# EAGLE board firetirs (EAGLE 7.7.0), part 1 of 2
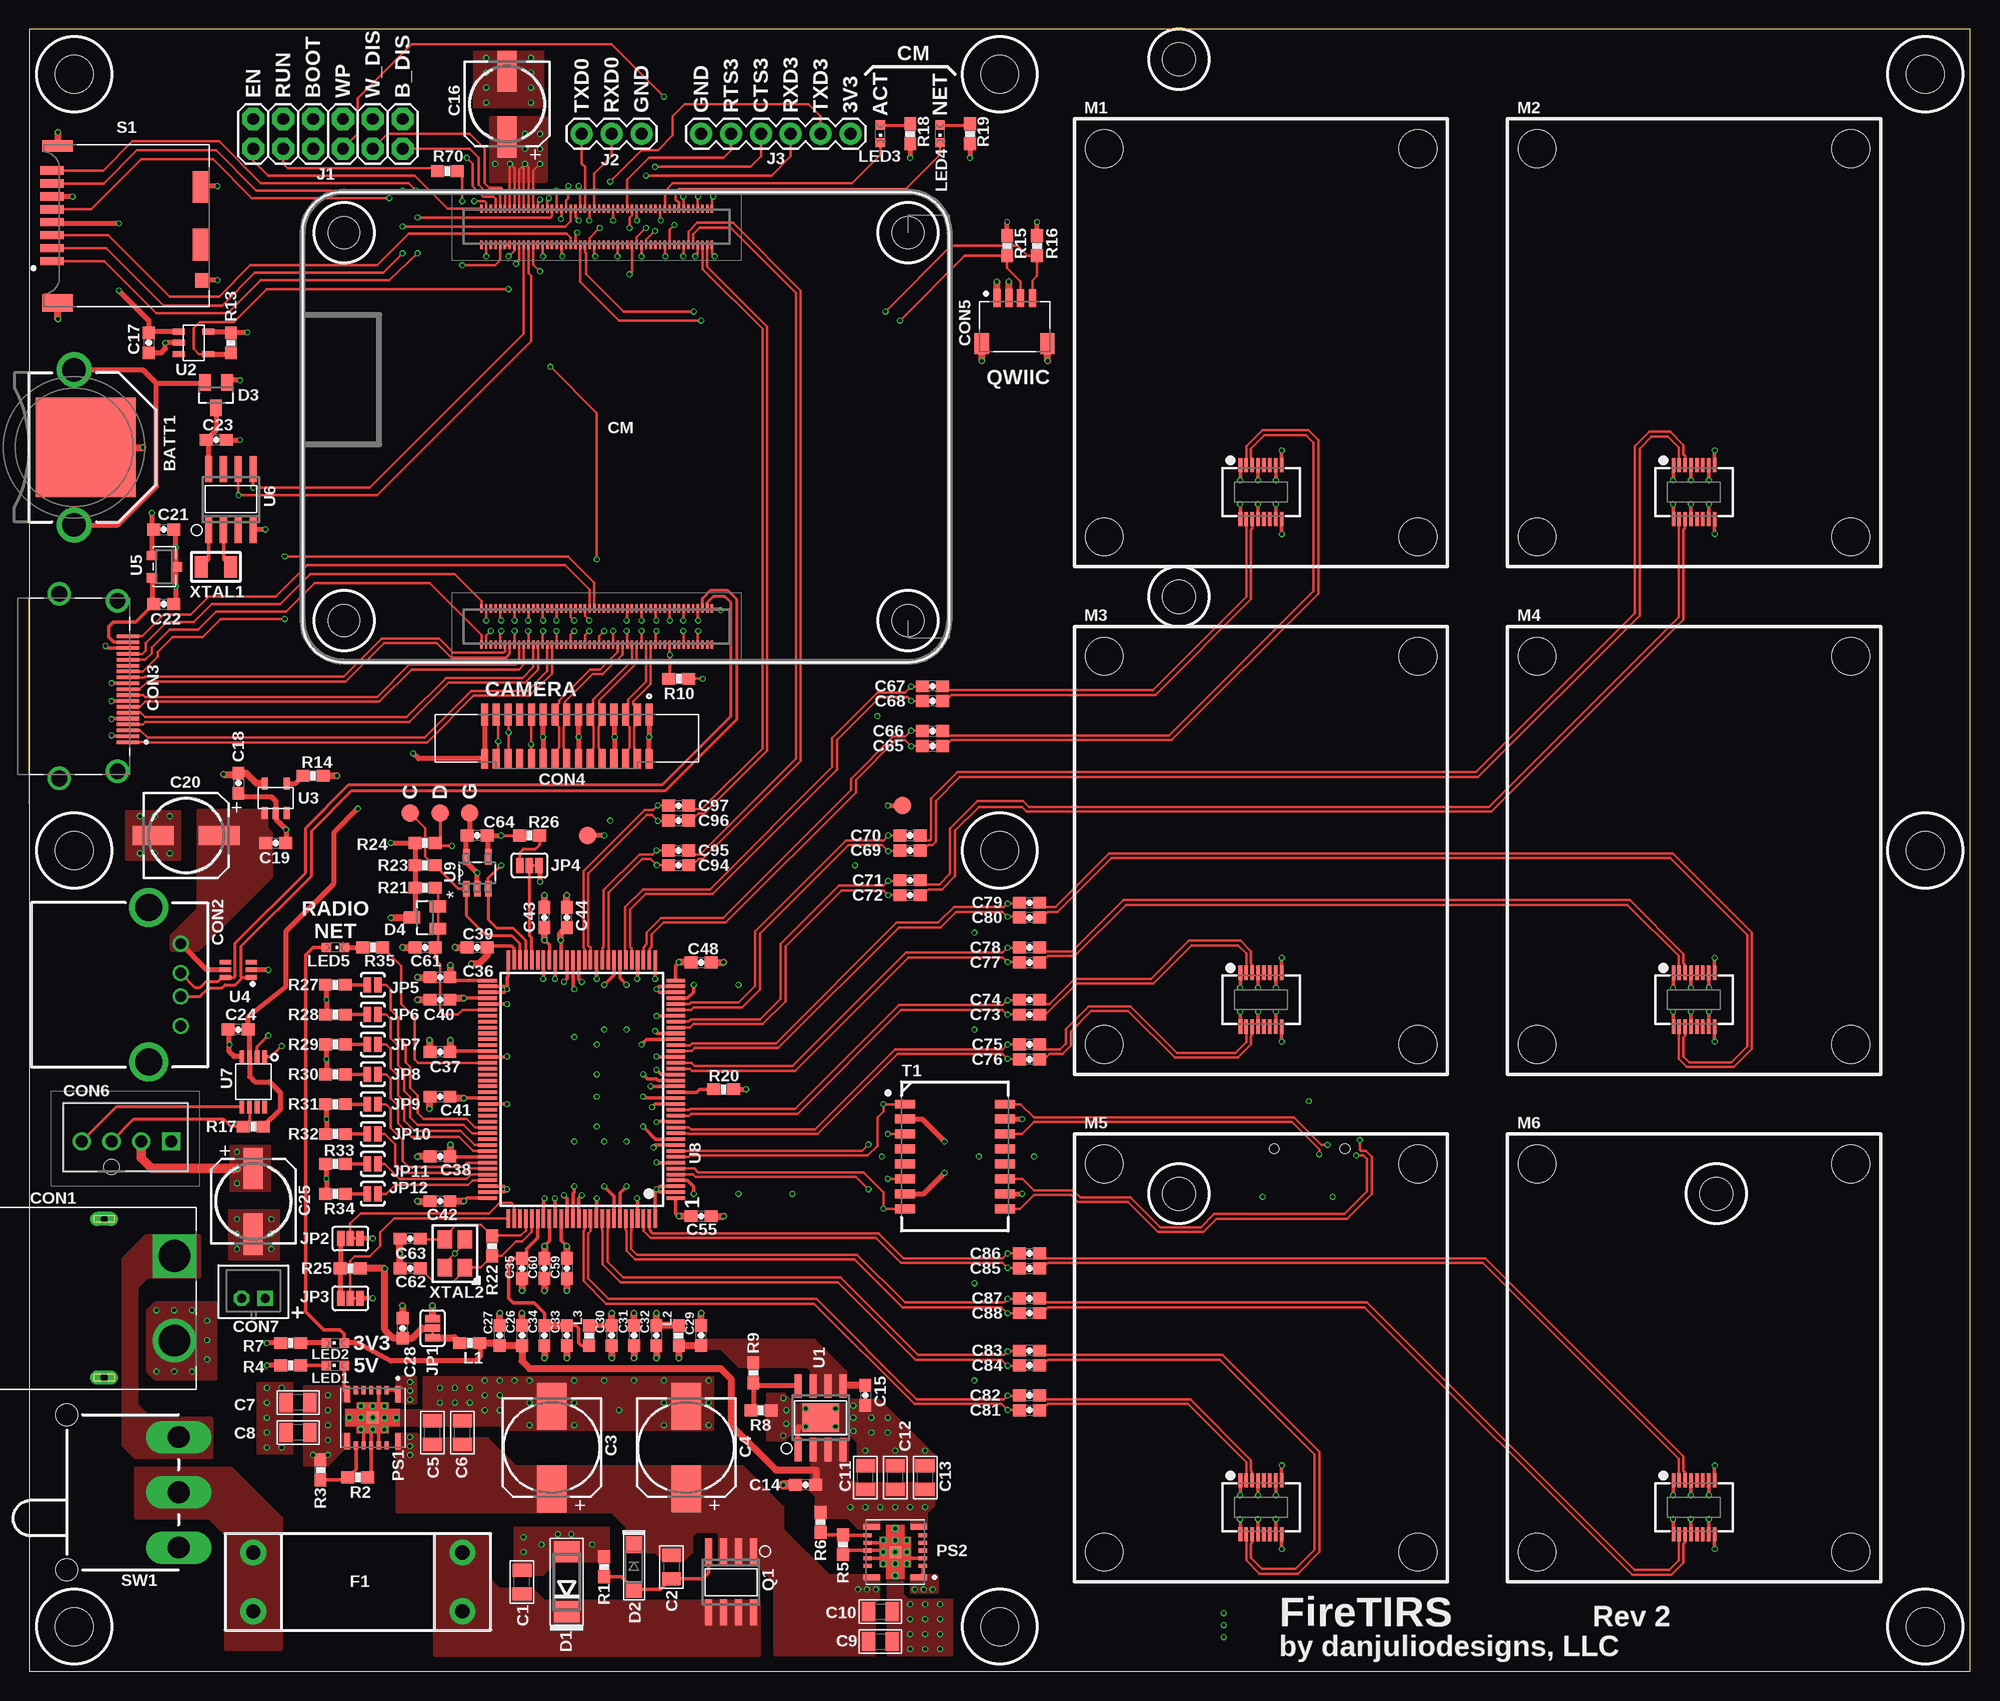
[diagram p7: board, top side]
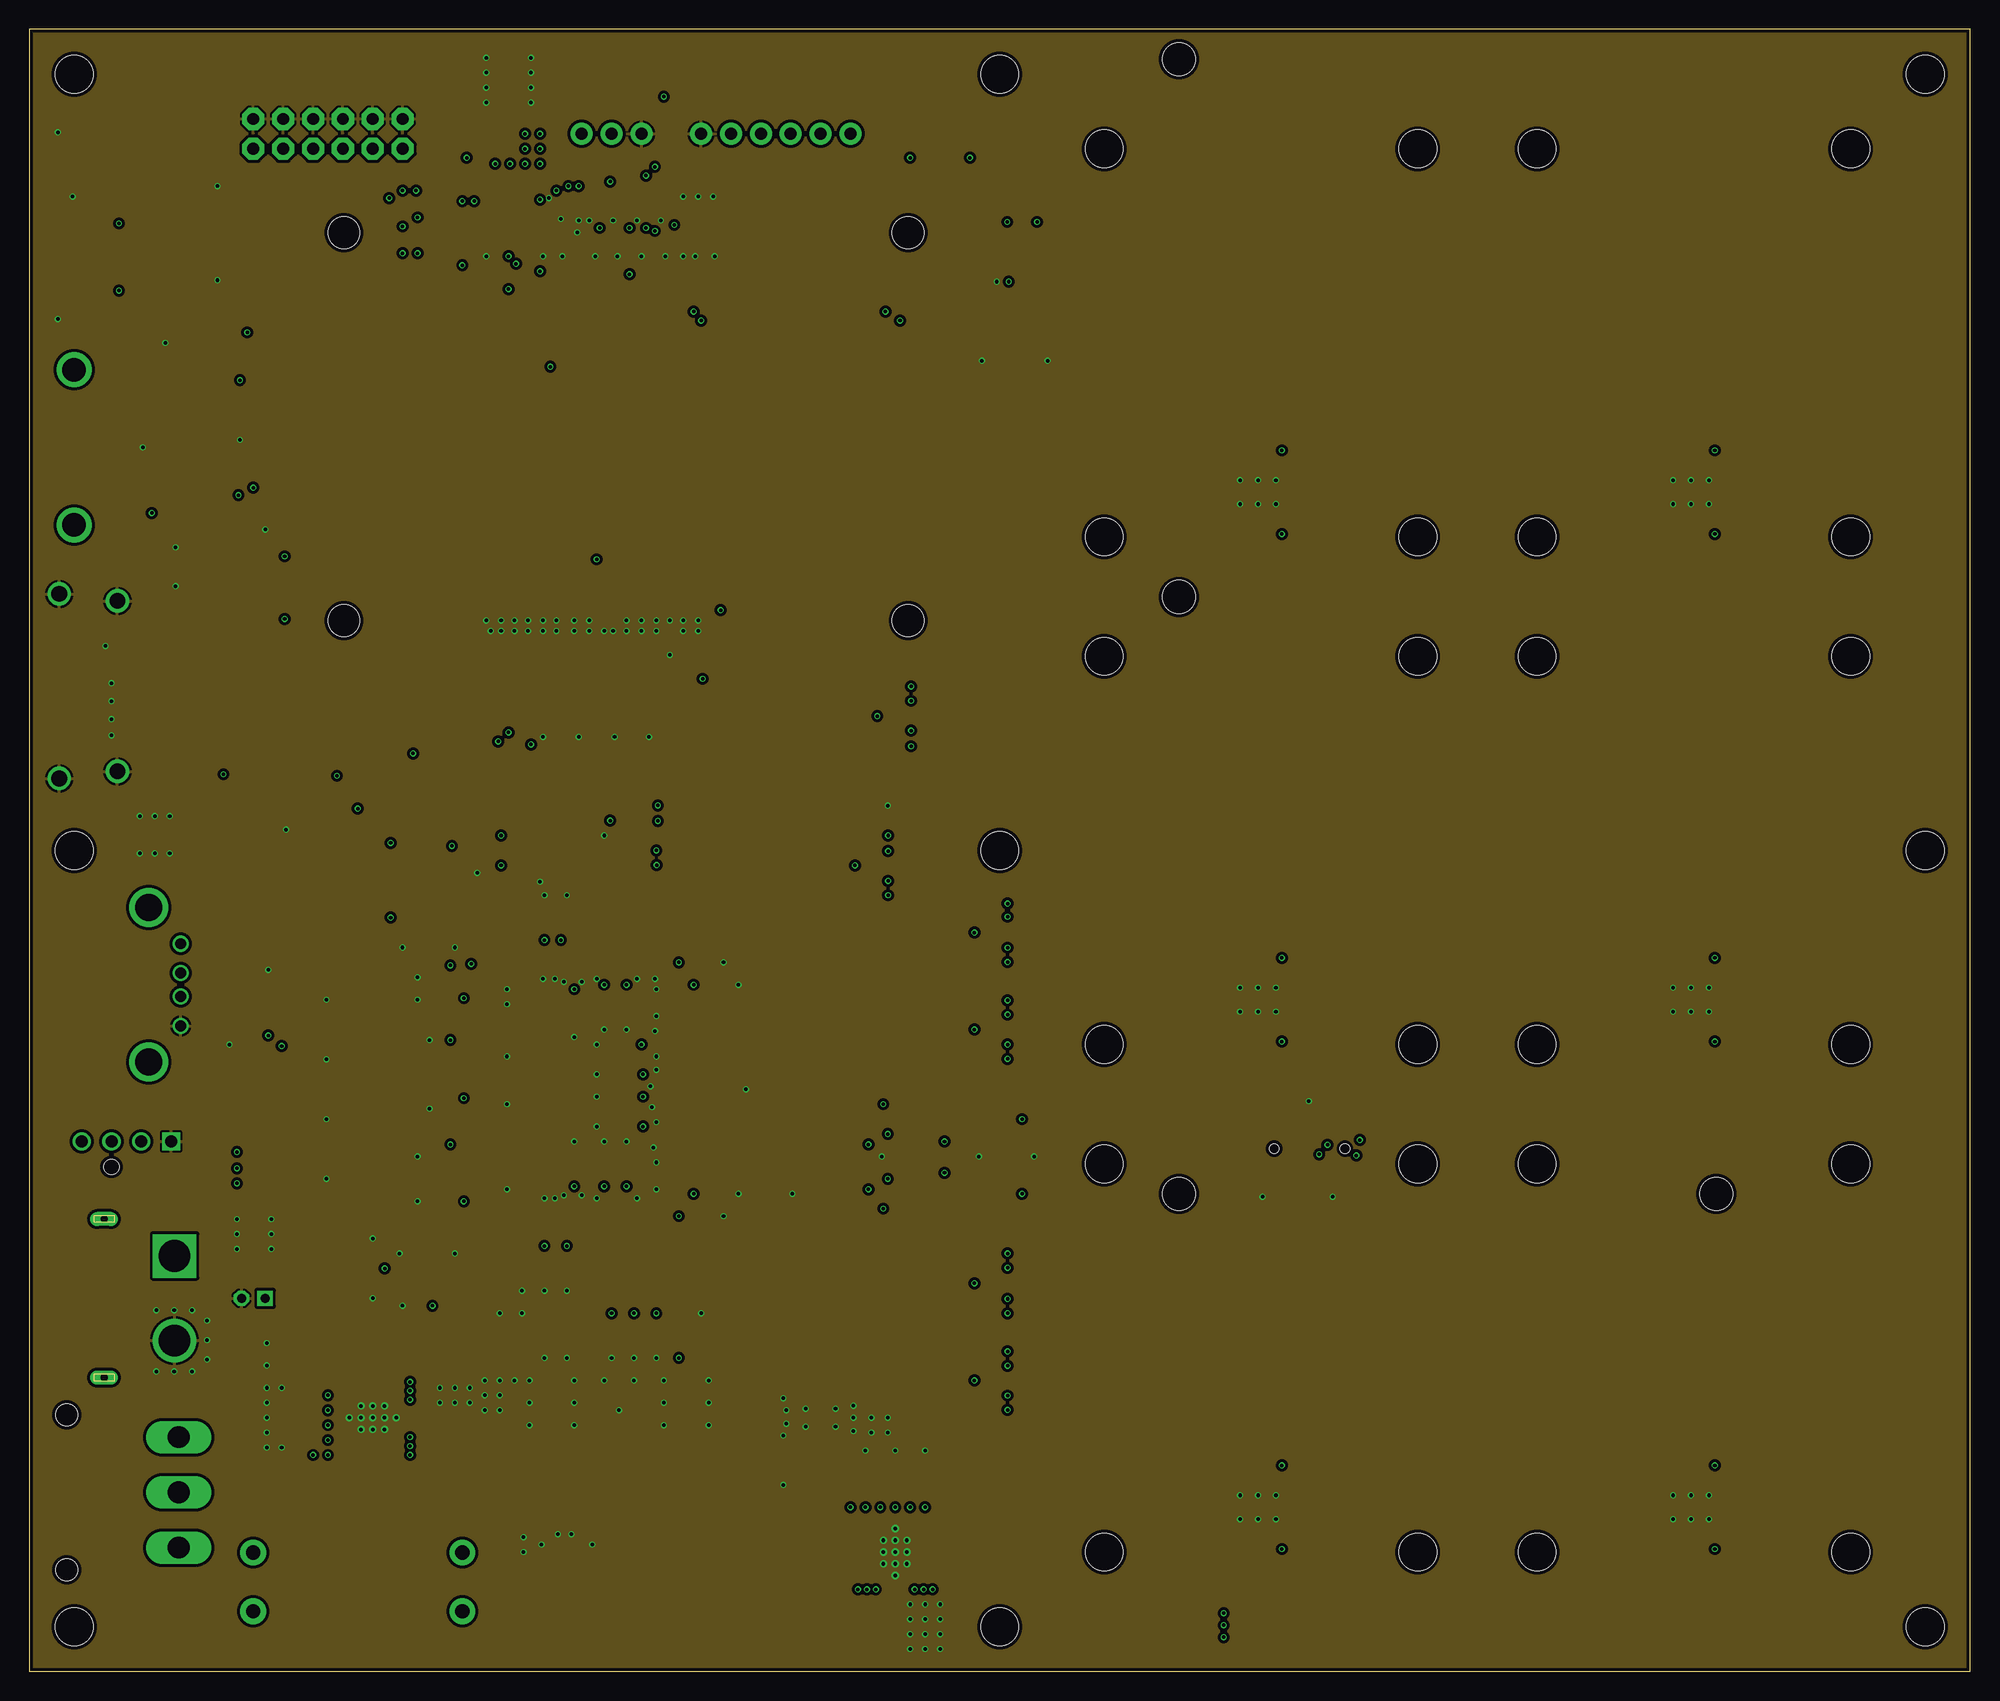
[diagram p8: board, inner layer Route2]
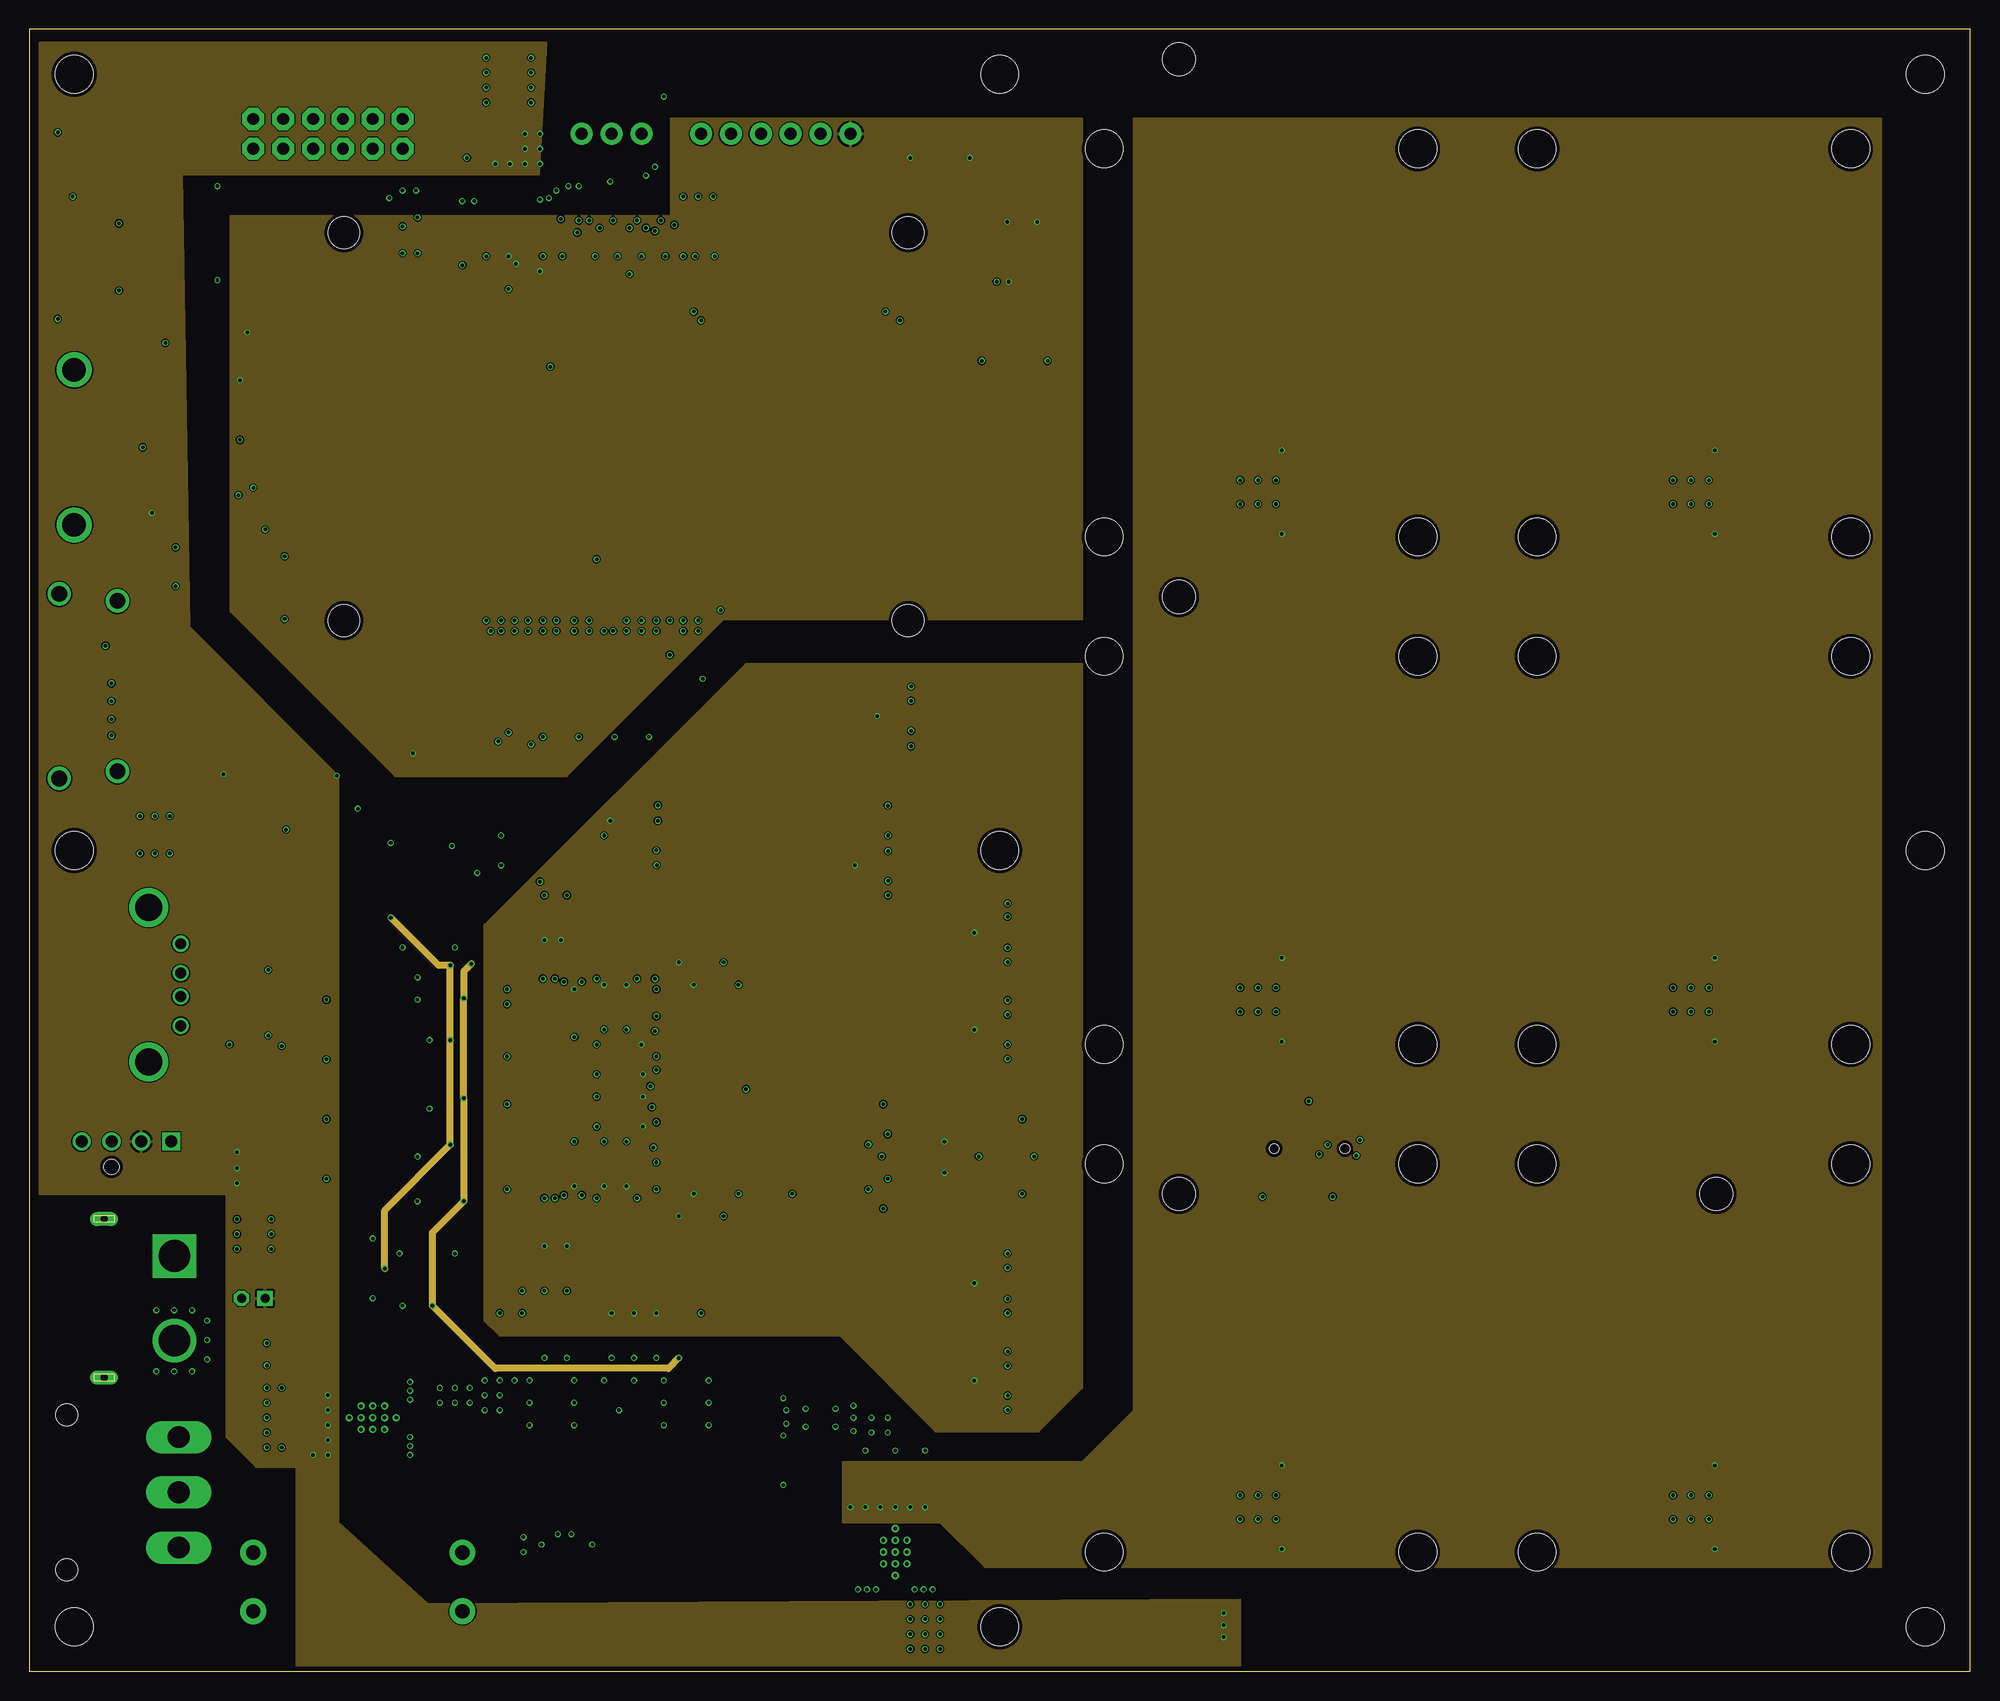
[diagram p9: board, inner layer Route15]
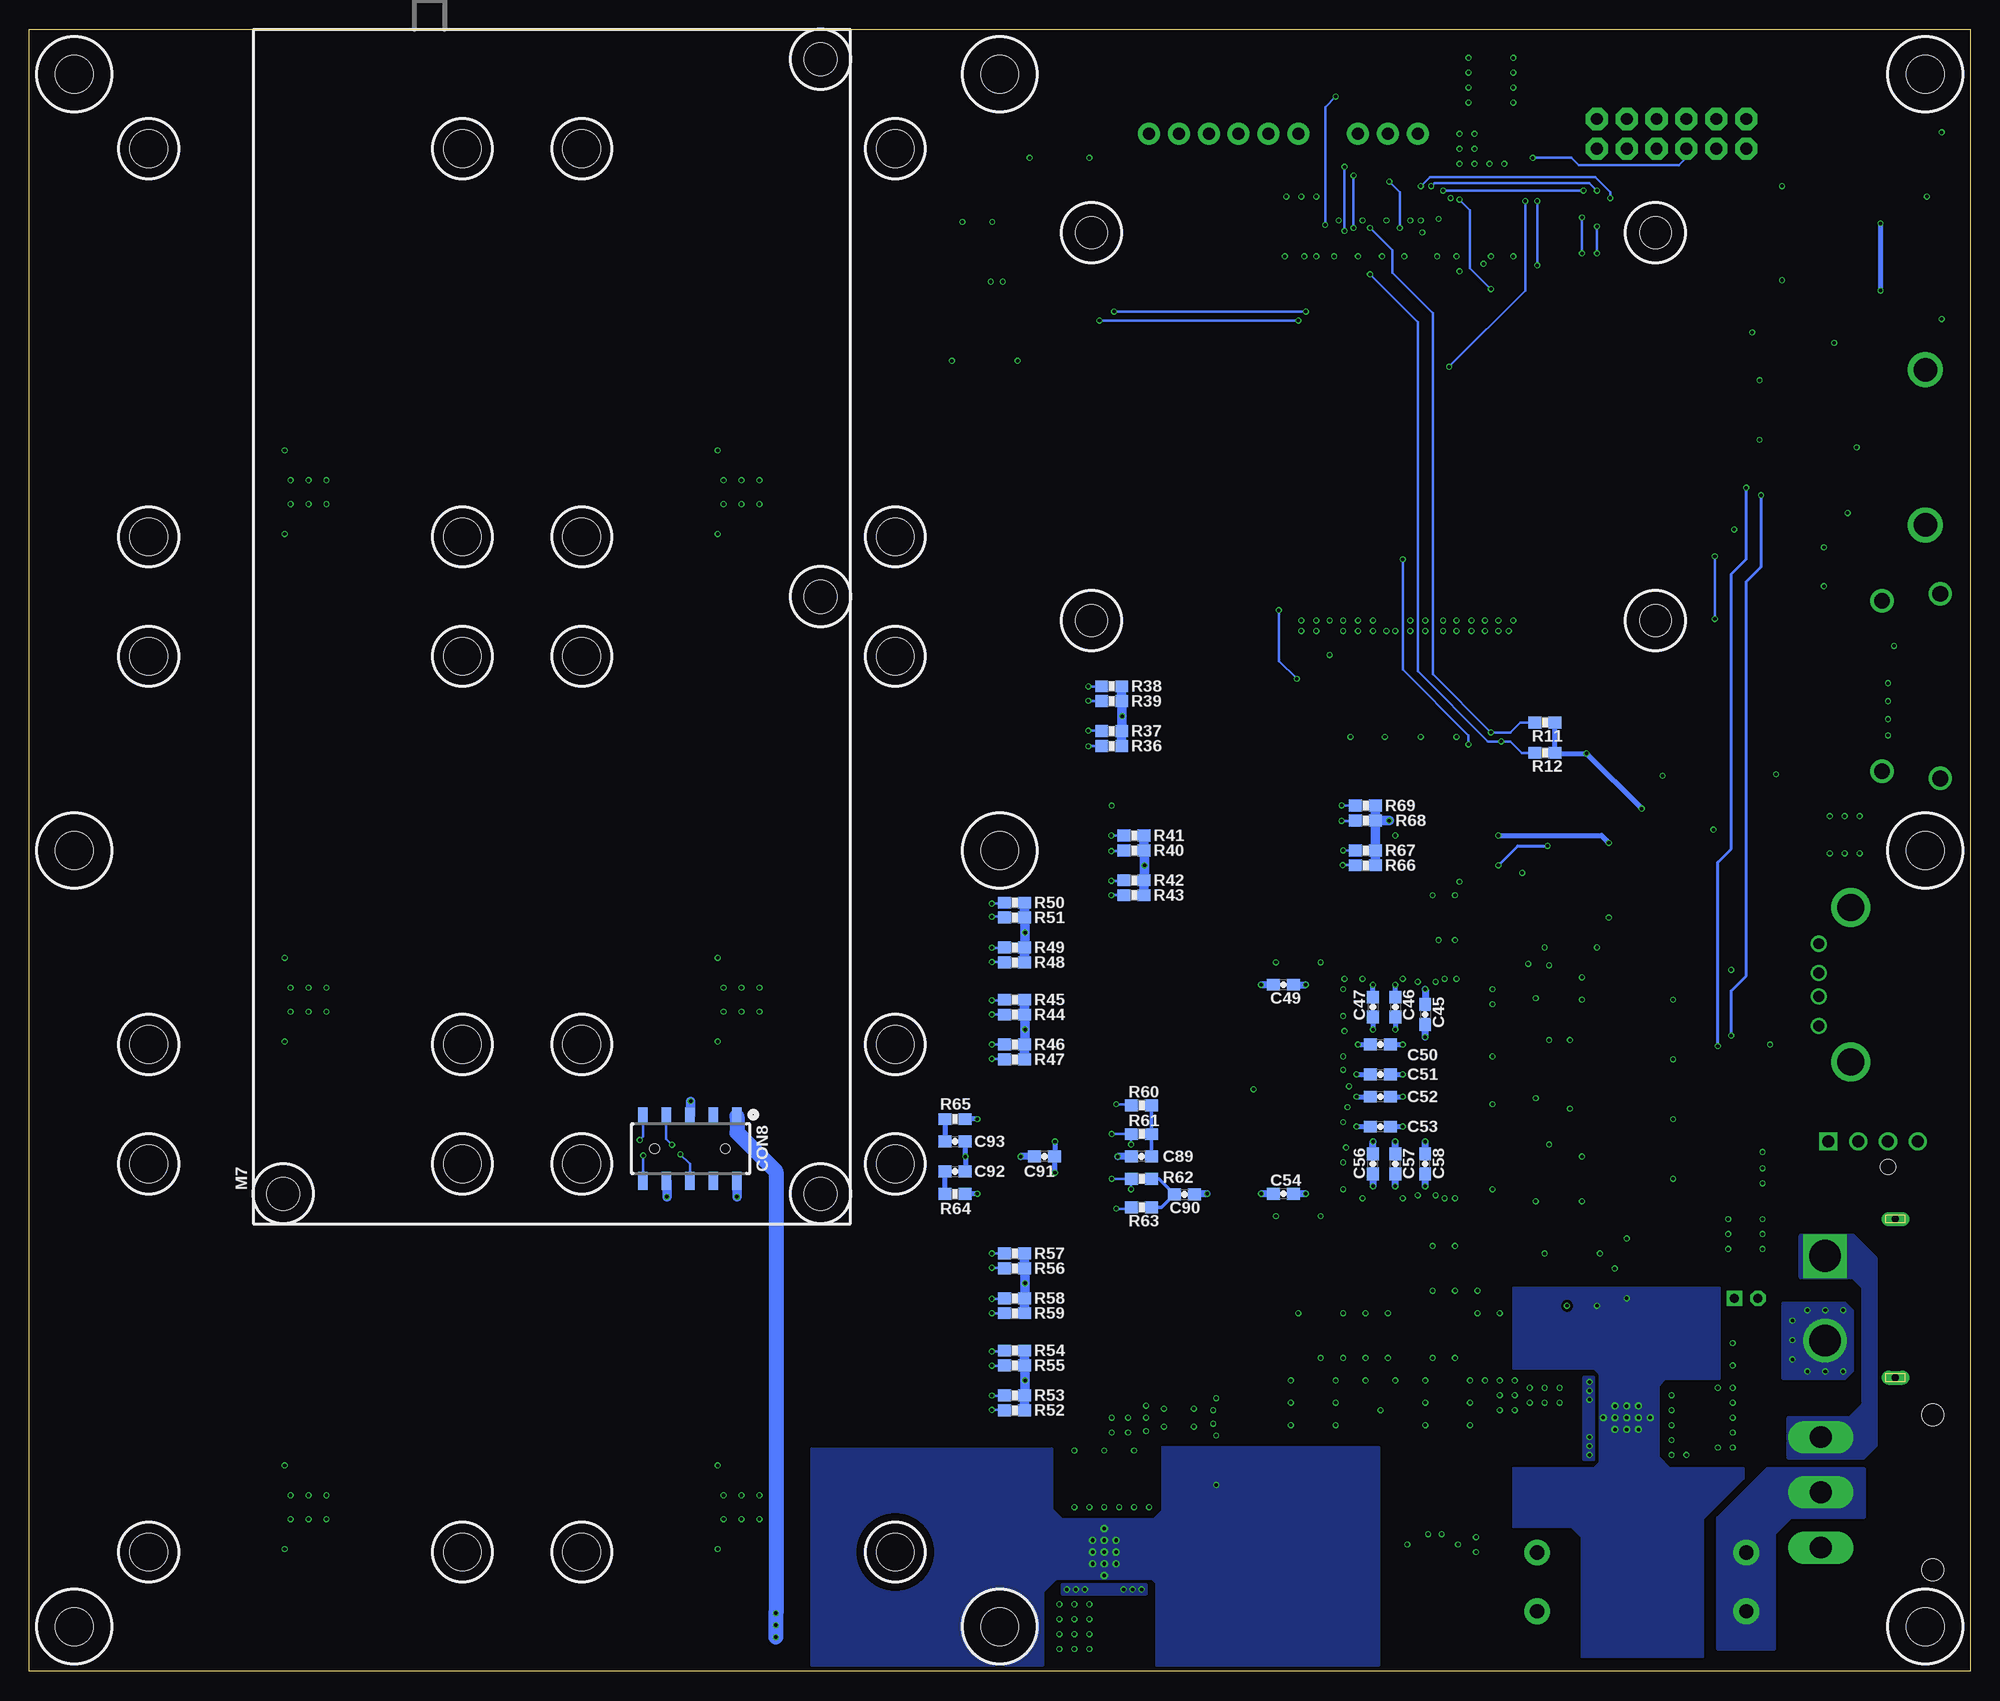
[diagram p10: board, bottom side, seen from below]

Size 165.1 x 139.7 mm. Coordinates in mm from the lower left corner, seen from the top.
Outline: 0,0 165.1,0 165.1,139.7 0,139.7 0,0
Copper layers (1+2*15+16): Top 0.035mm / dielectric 0.11mm / Route2 0.035mm / dielectric 1.2mm / Route15 0.035mm / dielectric 0.11mm / Bottom 0.035mm
Design rules "PCBWay_4L_100um-Track": minimum track width 0.1mm, minimum drill 0.3mm, track to track 0.1mm, track to pad 0.1mm, pad to pad 0.1mm, via to via 0.1mm, smd to smd 0mil, copper to edge 0.3mm, drill to drill 10mil, minimum pad ring 6mil, minimum via ring 0.1mm, stop-mask expansion 2mil, vias tented up to drill 0.45mm, thermal gap 0.2mm
Holes 3.2 mm at 3.81,3.81 3.81,135.89 161.29,3.81 161.29,135.89 161.29,69.85 82.55,135.89 82.55,69.85 3.81,69.85 82.55,3.81
bRestrict: area 79.4,0.6 to 85.7,7; area 88.3,7 to 94.6,13.3

## Footprints (pad centres in the part's own frame; a part is rotated, then mirrored left to right if it is on the bottom)
KEYSTONE_3001 = drill 2: +1 -6.604,0; +2 6.604,0 | smd 8.5 x 8.5: - 0,-1
C0805 = smd 1.1 x 1.6: 1 -1,0; 2 1,0
ECAP-0810 = smd 4 x 2.5: + 3.5,0; - -3.5,0
C0603 = smd 1.1 x 1: 1 -0.85,0; 2 0.85,0
ECAP-0606 = smd 3.5 x 1.6: + 2.8,0; - -2.8,0
RASPBERRYPI-CM4 = smd 0.2 x 0.7: 1 9.8,35.54; 2 9.8,32.46; 3 9.4,35.54; 4 9.4,32.46; 5 9,35.54; 6 9,32.46; 7 8.6,35.54; 8 8.6,32.46; 9 8.2,35.54; 10 8.2,32.46; 11 7.8,35.54; 12 7.8,32.46; 13 7.4,35.54; 14 7.4,32.46; 15 7,35.54; 16 7,32.46; 17 6.6,35.54; 18 6.6,32.46; 19 6.2,35.54; 20 6.2,32.46; 21 5.8,35.54; 22 5.8,32.46; 23 5.4,35.54; 24 5.4,32.46; 25 5,35.54; 26 5,32.46; 27 4.6,35.54; 28 4.6,32.46; 29 4.2,35.54; 30 4.2,32.46; 31 3.8,35.54; 32 3.8,32.46; 33 3.4,35.54; 34 3.4,32.46; 35 3,35.54; 36 3,32.46; 37 2.6,35.54; 38 2.6,32.46; 39 2.2,35.54; 40 2.2,32.46; 41 1.8,35.54; 42 1.8,32.46; 43 1.4,35.54; 44 1.4,32.46; 45 1,35.54; 46 1,32.46; 47 0.6,35.54; 48 0.6,32.46; 49 0.2,35.54; 50 0.2,32.46; 51 -0.2,35.54; 52 -0.2,32.46; 53 -0.6,35.54; 54 -0.6,32.46; 55 -1,35.54; 56 -1,32.46; 57 -1.4,35.54; 58 -1.4,32.46; 59 -1.8,35.54; 60 -1.8,32.46; 61 -2.2,35.54; 62 -2.2,32.46; 63 -2.6,35.54; 64 -2.6,32.46; 65 -3,35.54; 66 -3,32.46; 67 -3.4,35.54; 68 -3.4,32.46; 69 -3.8,35.54; 70 -3.8,32.46; 71 -4.2,35.54; 72 -4.2,32.46; 73 -4.6,35.54; 74 -4.6,32.46; 75 -5,35.54; 76 -5,32.46; 77 -5.4,35.54; 78 -5.4,32.46; 79 -5.8,35.54; 80 -5.8,32.46; 81 -6.2,35.54; 82 -6.2,32.46; 83 -6.6,35.54; 84 -6.6,32.46; 85 -7,35.54; 86 -7,32.46; 87 -7.4,35.54; 88 -7.4,32.46; 89 -7.8,35.54; 90 -7.8,32.46; 91 -8.2,35.54; 92 -8.2,32.46; 93 -8.6,35.54; 94 -8.6,32.46; 95 -9,35.54; 96 -9,32.46; 97 -9.4,35.54; 98 -9.4,32.46; 99 -9.8,35.54; 100 -9.8,32.46; 101 9.8,1.54; 102 9.8,-1.54; 103 9.4,1.54; 104 9.4,-1.54; 105 9,1.54; 106 9,-1.54; 107 8.6,1.54; 108 8.6,-1.54; 109 8.2,1.54; 110 8.2,-1.54; 111 7.8,1.54; 112 7.8,-1.54; 113 7.4,1.54; 114 7.4,-1.54; 115 7,1.54; 116 7,-1.54; 117 6.6,1.54; 118 6.6,-1.54; 119 6.2,1.54; 120 6.2,-1.54; 121 5.8,1.54; 122 5.8,-1.54; 123 5.4,1.54; 124 5.4,-1.54; 125 5,1.54; 126 5,-1.54; 127 4.6,1.54; 128 4.6,-1.54; 129 4.2,1.54; 130 4.2,-1.54; 131 3.8,1.54; 132 3.8,-1.54; 133 3.4,1.54; 134 3.4,-1.54; 135 3,1.54; 136 3,-1.54; 137 2.6,1.54; 138 2.6,-1.54; 139 2.2,1.54; 140 2.2,-1.54; 141 1.8,1.54; 142 1.8,-1.54; 143 1.4,1.54; 144 1.4,-1.54; 145 1,1.54; 146 1,-1.54; 147 0.6,1.54; 148 0.6,-1.54; 149 0.2,1.54; 150 0.2,-1.54; 151 -0.2,1.54; 152 -0.2,-1.54; 153 -0.6,1.54; 154 -0.6,-1.54; 155 -1,1.54; 156 -1,-1.54; 157 -1.4,1.54; 158 -1.4,-1.54; 159 -1.8,1.54; 160 -1.8,-1.54; 161 -2.2,1.54; 162 -2.2,-1.54; 163 -2.6,1.54; 164 -2.6,-1.54; 165 -3,1.54; 166 -3,-1.54; 167 -3.4,1.54; 168 -3.4,-1.54; 169 -3.8,1.54; 170 -3.8,-1.54; 171 -4.2,1.54; 172 -4.2,-1.54; 173 -4.6,1.54; 174 -4.6,-1.54; 175 -5,1.54; 176 -5,-1.54; 177 -5.4,1.54; 178 -5.4,-1.54; 179 -5.8,1.54; 180 -5.8,-1.54; 181 -6.2,1.54; 182 -6.2,-1.54; 183 -6.6,1.54; 184 -6.6,-1.54; 185 -7,1.54; 186 -7,-1.54; 187 -7.4,1.54; 188 -7.4,-1.54; 189 -7.8,1.54; 190 -7.8,-1.54; 191 -8.2,1.54; 192 -8.2,-1.54; 193 -8.6,1.54; 194 -8.6,-1.54; 195 -9,1.54; 196 -9,-1.54; 197 -9.4,1.54; 198 -9.4,-1.54; 199 -9.8,1.54; 200 -9.8,-1.54 | hole 2.7: -21.5,33.5; 26.5,33.5; -21.5,0.5; 26.5,0.5
AMASS_XT60PW-M = drill 2.7 square: 1 3.6,-6 | drill 2.7: 2 -3.6,-6 | drill 0.6 pad 1.2 long: S1 6.75,0; S2 -6.75,0
FCI_87520 = drill 0.92: 1 -3.5,2.71; 2 -1,2.71; 3 1,2.71; 4 3.5,2.71 | drill 2.3: SH1 -6.57,0; SH2 6.57,0
AMPHENOL_10029449-111RLF = smd 0.3 x 1.9: 1 4.75,5.85; 2 4.25,5.85; 3 3.75,5.85; 4 3.25,5.85; 5 2.75,5.85; 6 2.25,5.85; 7 1.75,5.85; 8 1.25,5.85; 9 0.75,5.85; 10 0.25,5.85; 11 -0.25,5.85; 12 -0.75,5.85; 13 -1.25,5.85; 14 -1.75,5.85; 15 -2.25,5.85; 16 -2.75,5.85; 17 -3.25,5.85; 18 -3.75,5.85; 19 -4.25,5.85 | drill 1.33: S1 -7.25,4.95; S2 7.25,4.95; S3 -7.85,0; S4 7.85,0
TE_1-1734248-5 = smd 0.6 x 1.85: 1 -7,-2.025; 2 -6,-2.025; 3 -5,-2.025; 4 -4,-2.025; 5 -3,-2.025; 6 -2,-2.025; 7 -1,-2.025; 8 0,-2.025; 9 1,-2.025; 10 2,-2.025; 11 3,-2.025; 12 4,-2.025; 13 5,-2.025; 14 6,-2.025; 15 7,-2.025 | smd 0.6 x 1.65: 1_1 -7,1.725; 2_1 -6,1.725; 3_1 -5,1.725; 4_1 -4,1.725; 5_1 -3,1.725; 6_1 -2,1.725; 7_1 -1,1.725; 8_1 0,1.725; 9_1 1,1.725; 10_1 2,1.725; 11_1 3,1.725; 12_1 4,1.725; 13_1 5,1.725; 14_1 6,1.725; 15_1 7,1.725
JST_SM04B-SRSS-TB(LF)(SN) = smd 0.6 x 1.55: 1 -1.5,0; 2 -0.5,0; 3 0.5,0; 4 1.5,0 | smd 1.2 x 1.8: S1 -2.8,-3.875; S2 2.8,-3.875
470531000 = drill 1.02 pad 1.53 square: 1 0,0 | drill 1.02 pad 1.55: 2 -2.54,0; 3 -5.08,0; 4 -7.62,0 | hole 1.3: -5.08,-2.16
B2B-PH-K-S = drill 0.75 pad 1.3 square: 1 1,0 | drill 0.75 pad 1.3 octagon: 2 -1,0
DO214AA = smd 1.8 x 2.2: A 2.55,0; C -2.55,0
SOD123 = smd 1.4 x 1.4: A 1.9,0; C -1.9,0
SOT23 = smd 1 x 1.4: 1 -0.95,-1.1; 2 0.95,-1.1; 3 0,1.1
FUSE_5_20_MM_SIDE = drill 1.2 pad 2.184: 1A -8.9,2.5; 1B -8.9,-2.5; 2A 8.9,2.5; 2B 8.9,-2.5
2X6 = drill 1.016 pad 1.88 octagon: 1 0,0; 2 0,2.54; 3 2.54,0; 4 2.54,2.54; 5 5.08,0; 6 5.08,2.54; 7 7.62,0; 8 7.62,2.54; 9 10.16,0; 10 10.16,2.54; 11 12.7,0; 12 12.7,2.54
1X03 = drill 1.016 pad 1.88: 1 0,0; 2 2.54,0; 3 5.08,0
1X06 = drill 1.016 pad 1.88: 1 0,0; 2 2.54,0; 3 5.08,0; 4 7.62,0; 5 10.16,0; 6 12.7,0
PAD-JUMPER-3-2OF3_NC_BY_TRACE_YES_SILK_FULL_BOX = smd 0.635 x 1.27: 1 -0.813,0; 2 0,0; 3 0.813,0
PAD-JUMPER-2-NO_YES_SILK = smd 0.635 x 1.27: 1 -0.45,0; 2 0.45,0
L0603 = smd 1.1 x 1: 1 -0.85,0; 2 0.85,0
CHIPLED_0603 = smd 0.8 x 0.8: A 0,-0.75; C 0,0.75
TCAM-ETH = smd 0.3 x 1.2: P$1 -1.75,2.3; P$2 -1.25,2.3; P$3 -0.75,2.3; P$4 -0.25,2.3; P$5 0.25,2.3; P$6 0.75,2.3; P$7 1.25,2.3; P$8 1.75,2.3; P$9 1.75,-2.3; P$10 1.25,-2.3; P$11 0.75,-2.3; P$12 0.25,-2.3; P$13 -0.25,-2.3; P$14 -0.75,-2.3; P$15 -1.25,-2.3; P$16 -1.75,-2.3 | hole 3.2: -13.335,-3.81; 13.335,-3.81; -13.335,29.21; 13.335,29.21
FREEWAVE_Z9_PC = smd 1.5 x 0.8: P$1 2.75,-4; P$2 -2.75,-4; P$3 2.75,-2; P$4 -2.75,-2; P$5 2.75,0; P$6 -2.75,0; P$7 2.75,2; P$8 -2.75,2; P$9 2.75,4; P$10 -2.75,4 | hole 0.8: 0,-3; 0,3 | hole 2.8: -3.856,-11.122; 46.944,-11.122; 92.664,-11.122; -3.856,34.598
CONV_RPX-4.0-CT = smd 1.4 x 0.5: 1 -2,2.145; 7 -2,-2.155; 8 2,-2.155; 14 2,2.145 | smd 0.7 x 0.35: 2 -2.35,1.17; 3 -2.35,0.52; 4 -2.35,-0.13; 5 -2.35,-0.78; 6 -2.35,-1.43; 9 2.35,-1.43; 10 2.35,-0.78; 11 2.35,-0.13; 12 2.35,0.52; 13 2.35,1.17 | smd 1 x 1: 15_1 0,0 | drill 0.3 pad 0.406: 15_2 0,2; 15_3 0,1; 15_4 0,0; 15_5 0,-1; 15_6 0,-2; 15_7 1,-1; 15_8 1,0; 15_9 1,1; 15_10 -1,1; 15_11 -1,0; 15_12 -1,-1
SO8 = smd 0.6 x 2.2: 1 -1.905,-2.6; 2 -0.635,-2.6; 3 0.635,-2.6; 4 1.905,-2.6; 5 1.905,2.6; 6 0.635,2.6; 7 -0.635,2.6; 8 -1.905,2.6
R0603 = smd 1.1 x 1: 1 -0.85,0; 2 0.85,0
HRS_DM3CS-SF = smd 0.7 x 2: 1 3.2,-6.35; 2 2.1,-6.35; 3 1,-6.35; 4 -0.1,-6.35; 5 -1.2,-6.35; 6 -2.3,-6.35; 7 -3.4,-6.35; 8 -4.5,-6.35 | smd 2.7 x 1.4: 9 1.8,6.35; S3 -3.1,6.35 | smd 1 x 2.6: S1 -6.6,-5.85 | smd 1.5 x 2.6: S2 6.75,-5.85 | smd 1.2 x 1.2: S5 4.85,6.45
SIDE_PWR_SPDT = drill 1.85 long: 1 -4.7,0; 2 0,0; 3 4.7,0 | hole 1.85: -6.6,9.52; 6.6,9.52
XFMR_HX2019FNLT = smd 1.7 x 0.76: 1 -4.255,4.445; 2 -4.255,3.175; 3 -4.255,1.905; 4 -4.255,0.635; 5 -4.255,-0.635; 6 -4.255,-1.905; 7 -4.255,-3.175; 8 -4.255,-4.445; 9 4.255,-4.445; 10 4.255,-3.175; 11 4.255,-1.905; 12 4.255,-0.635; 13 4.255,0.635; 14 4.255,1.905; 15 4.255,3.175; 16 4.255,4.445
1_5MM_R_SMD_PAD = smd 1.5 x 1.5: P$1 0,0
SO8_PAD = smd 0.6 x 2: 1 -1.905,-2.7; 2 -0.635,-2.7; 3 0.635,-2.7; 4 1.905,-2.7; 5 1.905,2.7; 6 0.635,2.7; 7 -0.635,2.7; 8 -1.905,2.7 | smd 3.1 x 2.4: PAD 0,0
TSOT-23-5 = smd 0.508 x 1.016: P$1 -0.95,-1.25; P$2 0,-1.25; P$3 0.95,-1.25; P$4 0.95,1.25; P$5 -0.95,1.25
SOT65P220X95-6N = smd 0.95 x 0.4: 1 -1.1,0.65; 2 -1.1,0; 3 -1.1,-0.65; 4 1.1,-0.65; 5 1.1,0; 6 1.1,0.65
SOT23-3 = smd 0.8 x 0.9: 1 -0.95,-1; 2 0.95,-1; 3 0,1.1
MSOP8 = smd 1.05 x 0.41: 1 -2.15,0.975; 2 -2.15,0.325; 3 -2.15,-0.325; 4 -2.15,-0.975; 5 2.15,-0.975; 6 2.15,-0.325; 7 2.15,0.325; 8 2.15,0.975
PQFP128-PQ = smd 0.3 x 1.6: 1 -9.25,-8; 2 -8.75,-8; 3 -8.25,-8; 4 -7.75,-8; 5 -7.25,-8; 6 -6.75,-8; 7 -6.25,-8; 8 -5.75,-8; 9 -5.25,-8; 10 -4.75,-8; 11 -4.25,-8; 12 -3.75,-8; 13 -3.25,-8; 14 -2.75,-8; 15 -2.25,-8; 16 -1.75,-8; 17 -1.25,-8; 18 -0.75,-8; 19 -0.25,-8; 20 0.25,-8; 21 0.75,-8; 22 1.25,-8; 23 1.75,-8; 24 2.25,-8; 25 2.75,-8; 26 3.25,-8; 27 3.75,-8; 28 4.25,-8; 29 4.75,-8; 30 5.25,-8; 31 5.75,-8; 32 6.25,-8; 33 6.75,-8; 34 7.25,-8; 35 7.75,-8; 36 8.25,-8; 37 8.75,-8; 38 9.25,-8; 65 9.25,8; 66 8.75,8; 67 8.25,8; 68 7.75,8; 69 7.25,8; 70 6.75,8; 71 6.25,8; 72 5.75,8; 73 5.25,8; 74 4.75,8; 75 4.25,8; 76 3.75,8; 77 3.25,8; 78 2.75,8; 79 2.25,8; 80 1.75,8; 81 1.25,8; 82 0.75,8; 83 0.25,8; 84 -0.25,8; 85 -0.75,8; 86 -1.25,8; 87 -1.75,8; 88 -2.25,8; 89 -2.75,8; 90 -3.25,8; 91 -3.75,8; 92 -4.25,8; 93 -4.75,8; 94 -5.25,8; 95 -5.75,8; 96 -6.25,8; 97 -6.75,8; 98 -7.25,8; 99 -7.75,8; 100 -8.25,8; 101 -8.75,8; 102 -9.25,8 | smd 1.6 x 0.3: 39 11,-6.25; 40 11,-5.75; 41 11,-5.25; 42 11,-4.75; 43 11,-4.25; 44 11,-3.75; 45 11,-3.25; 46 11,-2.75; 47 11,-2.25; 48 11,-1.75; 49 11,-1.25; 50 11,-0.75; 51 11,-0.25; 52 11,0.25; 53 11,0.75; 54 11,1.25; 55 11,1.75; 56 11,2.25; 57 11,2.75; 58 11,3.25; 59 11,3.75; 60 11,4.25; 61 11,4.75; 62 11,5.25; 63 11,5.75; 64 11,6.25; 103 -11,6.25; 104 -11,5.75; 105 -11,5.25; 106 -11,4.75; 107 -11,4.25; 108 -11,3.75; 109 -11,3.25; 110 -11,2.75; 111 -11,2.25; 112 -11,1.75; 113 -11,1.25; 114 -11,0.75; 115 -11,0.25; 116 -11,-0.25; 117 -11,-0.75; 118 -11,-1.25; 119 -11,-1.75; 120 -11,-2.25; 121 -11,-2.75; 122 -11,-3.25; 123 -11,-3.75; 124 -11,-4.25; 125 -11,-4.75; 126 -11,-5.25; 127 -11,-5.75; 128 -11,-6.25
SOT95P270X145-5N = smd 1.321 x 0.559: 1 -1.372,0.94; 2 -1.372,0; 3 -1.372,-0.94; 4 1.372,-0.94; 5 1.372,0.94
CRYSTAL-3215 = smd 1.1 x 1.8: 1 -1.25,0; 2 1.25,0
CRYSTAL-3225 = smd 1.5 x 1.2: 1 -1.2,-0.85; 2 1.2,-0.85; 3 1.2,0.85; 4 -1.2,0.85

## Placement (x,y rotation side)
BATT1  [KEYSTONE_3001]  3.81,104.14 90 top
C1  0.1 uF  [C0805]  41.91,7.62 90 top
C2  0.1 uF  [C0805]  54.61,8.89 270 top
C3  470 uF  [ECAP-0810]  44.45,19.05 270 top
C4  470 uF  [ECAP-0810]  55.88,19.05 270 top
C5  10 uF  [C0805]  34.29,20.32 90 top
C6  10 uF  [C0805]  36.83,20.32 90 top
C7  47 uF  [C0805]  22.86,22.86 180 top
C8  47 uF  [C0805]  22.86,20.32 180 top
C9  10 uF  [C0805]  72.39,2.54 0 top
C10  10 uF  [C0805]  72.39,5.08 0 top
C11  47 uF  [C0805]  71.12,16.51 90 top
C12  47 uF  [C0805]  73.66,16.51 90 top
C13  47 uF  [C0805]  76.2,16.51 90 top
C14  10 uF  [C0603]  66.04,15.88 180 top
C15  10 uF  [C0603]  71.12,23.5 270 top
C16  120 uF  [ECAP-0606]  40.64,133.35 270 top
C17  10 uF  [C0603]  10.16,113.03 270 top
C18  10 uF  [C0603]  17.78,75.56 270 top
C19  0.1 uF  [C0603]  20.95,70.48 0 top
C20  120 uF  [ECAP-0606]  13.34,71.12 0 top
C21  0.1 uF  [C0603]  11.43,97.16 0 top
C22  0.1 uF  [C0603]  11.43,90.81 0 top
C23  0.1 uF  [C0603]  15.88,104.78 0 top
C24  0.1 uF  [C0603]  17.78,54.61 180 top
C25  120 uF  [ECAP-0606]  19.05,40.01 90 top
C26  10 uF  [C0603]  41.91,28.57 90 top
C27  0.1 uF  [C0603]  40.01,28.57 90 top
C28  10 uF  [C0603]  31.75,29.21 90 top
C29  0.1 uF  [C0603]  57.15,28.57 90 top
C30  10 uF  [C0603]  49.53,28.57 270 top
C31  0.01 uF  [C0603]  51.44,28.57 270 top
C32  0.1 uF  [C0603]  53.34,28.57 270 top
C33  10 uF  [C0603]  45.72,28.57 270 top
C34  0.01 uF  [C0603]  43.81,28.57 270 top
C35  0.1 uF  [C0603]  41.91,34.29 270 top
C36  0.1 uF  [C0603]  34.92,59.05 180 top
C37  0.1 uF  [C0603]  34.92,52.7 180 top
C38  0.1 uF  [C0603]  34.92,43.81 180 top
C39  0.1 uF  [C0603]  38.1,61.59 180 top
C40  0.1 uF  [C0603]  34.92,57.15 180 top
C41  0.1 uF  [C0603]  34.92,48.9 180 top
C42  0.1 uF  [C0603]  34.92,40.01 180 top
C43  0.1 uF  [C0603]  43.81,64.14 90 top
C44  0.1 uF  [C0603]  45.72,64.14 90 top
C45  0.1 uF  [C0603]  46.35,55.88 270 bottom
C46  0.1 uF  [C0603]  48.9,56.52 270 bottom
C47  0.1 uF  [C0603]  50.8,56.52 270 bottom
C48  0.1 uF  [C0603]  57.15,60.33 0 top
C49  0.1 uF  [C0603]  58.42,58.42 180 bottom
C50  0.1 uF  [C0603]  50.16,53.34 0 bottom
C51  0.1 uF  [C0603]  50.16,50.8 0 bottom
C52  0.1 uF  [C0603]  50.16,48.9 0 bottom
C53  0.1 uF  [C0603]  50.16,46.35 0 bottom
C54  0.1 uF  [C0603]  58.42,40.64 180 bottom
C55  0.1 uF  [C0603]  57.15,38.73 0 top
C56  0.1 uF  [C0603]  50.8,43.18 90 bottom
C57  0.1 uF  [C0603]  48.9,43.18 90 bottom
C58  0.1 uF  [C0603]  46.35,43.18 90 bottom
C59  0.1 uF  [C0603]  45.72,34.29 270 top
C60  0.1 uF  [C0603]  43.81,34.29 270 top
C61  0.1 uF  [C0603]  33.66,61.59 180 top
C62  33 pF  [C0603]  32.38,34.29 180 top
C63  33 pF  [C0603]  32.38,36.83 180 top
C64  DNP  [C0603]  38.1,71.12 180 top
C65  0.1 uF  [C0603]  76.83,78.74 0 top
C66  0.1 uF  [C0603]  76.83,80.01 0 top
C67  0.1 uF  [C0603]  76.83,83.82 180 top
C68  0.1 uF  [C0603]  76.83,82.55 180 top
C69  0.1 uF  [C0603]  74.93,69.85 0 top
C70  0.1 uF  [C0603]  74.93,71.12 0 top
C71  0.1 uF  [C0603]  74.93,67.31 180 top
C72  0.1 uF  [C0603]  74.93,66.04 180 top
C73  0.1 uF  [C0603]  85.09,55.88 0 top
C74  0.1 uF  [C0603]  85.09,57.15 0 top
C75  0.1 uF  [C0603]  85.09,53.34 180 top
C76  0.1 uF  [C0603]  85.09,52.07 180 top
C77  0.1 uF  [C0603]  85.09,60.33 0 top
C78  0.1 uF  [C0603]  85.09,61.59 0 top
C79  0.1 uF  [C0603]  85.09,65.41 180 top
C80  0.1 uF  [C0603]  85.09,64.14 180 top
C81  0.1 uF  [C0603]  85.09,22.23 0 top
C82  0.1 uF  [C0603]  85.09,23.5 0 top
C83  0.1 uF  [C0603]  85.09,27.3 180 top
C84  0.1 uF  [C0603]  85.09,26.04 180 top
C85  0.1 uF  [C0603]  85.09,34.29 0 top
C86  0.1 uF  [C0603]  85.09,35.56 0 top
C87  0.1 uF  [C0603]  85.09,31.75 180 top
C88  0.1 uF  [C0603]  85.09,30.48 180 top
C89  0.1 uF  [C0603]  70.48,43.81 180 bottom
C90  0.1 uF  [C0603]  66.83,40.59 0 bottom
C91  10 uF  [C0603]  78.74,43.81 180 bottom
C92  1 nF  [C0603]  86.36,42.55 0 bottom
C93  1 nF  [C0603]  86.36,45.09 0 bottom
C94  0.1 uF  [C0603]  55.24,68.58 0 top
C95  0.1 uF  [C0603]  55.24,69.85 0 top
C96  0.1 uF  [C0603]  55.24,72.39 0 top
C97  0.1 uF  [C0603]  55.24,73.66 0 top
CM  RASPBERRYPI-CM4  [RASPBERRYPI-CM4]  48.26,88.9 0 top
CON1  XT60PW-M  [AMASS_XT60PW-M]  6.35,31.75 90 top
CON2  [FCI_87520]  10.16,58.42 270 top
CON3  10029449-111RLF  [AMPHENOL_10029449-111RLF]  2.54,83.82 270 top
CON4  1-1734248-5  [TE_1-1734248-5]  45.72,79.38 180 top
CON5  SM04B-SRSS-TB(LF)(SN)  [JST_SM04B-SRSS-TB(LF)(SN)]  83.82,116.84 0 top
CON6  47053-1000  [470531000]  12.06,45.09 0 top
CON7  B2B-PH-K-S  [B2B-PH-K-S]  19.05,31.75 0 top
D1  SMBJ24  [DO214AA]  45.72,7.62 90 top
D2  12V  [SOD123]  51.44,8.89 270 top
D3  BAT54C  [SOT23]  15.88,108.58 180 top
D4  BAT54C  [SOT23]  33.66,64.14 90 top
F1  3A  [FUSE_5_20_MM_SIDE]  27.94,7.62 0 top
J1  2X6 FEMALE  [2X6]  19.05,129.54 0 top
J2  [1X03]  52.07,130.81 180 top
J3  [1X06]  57.15,130.81 0 top
JP1  JUMPER-PAD-3-2OF3_NC_BY_TRACE_SMALL  [PAD-JUMPER-3-2OF3_NC_BY_TRACE_YES_SILK_FULL_BOX]  34.29,29.21 270 top
JP2  JUMPER-PAD-3-2OF3_NC_BY_TRACE_SMALL  [PAD-JUMPER-3-2OF3_NC_BY_TRACE_YES_SILK_FULL_BOX]  27.3,36.83 0 top
JP3  JUMPER-PAD-3-2OF3_NC_BY_TRACE_SMALL  [PAD-JUMPER-3-2OF3_NC_BY_TRACE_YES_SILK_FULL_BOX]  27.3,31.75 0 top
JP4  JUMPER-PAD-3-2OF3_NC_BY_TRACE_SMALL  [PAD-JUMPER-3-2OF3_NC_BY_TRACE_YES_SILK_FULL_BOX]  42.55,68.58 0 top
JP5  JUMPER-PAD-2-NOYES_SILK  [PAD-JUMPER-2-NO_YES_SILK]  29.21,58.42 180 top
JP6  JUMPER-PAD-2-NOYES_SILK  [PAD-JUMPER-2-NO_YES_SILK]  29.21,55.88 180 top
JP7  JUMPER-PAD-2-NOYES_SILK  [PAD-JUMPER-2-NO_YES_SILK]  29.21,53.34 180 top
JP8  JUMPER-PAD-2-NOYES_SILK  [PAD-JUMPER-2-NO_YES_SILK]  29.21,50.8 180 top
JP9  JUMPER-PAD-2-NOYES_SILK  [PAD-JUMPER-2-NO_YES_SILK]  29.21,48.26 180 top
JP10  JUMPER-PAD-2-NOYES_SILK  [PAD-JUMPER-2-NO_YES_SILK]  29.21,45.72 180 top
JP11  JUMPER-PAD-2-NOYES_SILK  [PAD-JUMPER-2-NO_YES_SILK]  29.21,43.18 180 top
JP12  JUMPER-PAD-2-NOYES_SILK  [PAD-JUMPER-2-NO_YES_SILK]  29.21,40.64 180 top
L1  100ohm/2.5A  [L0603]  37.47,27.94 180 top
L2  100ohm/2.5A  [L0603]  55.24,28.57 90 top
L3  100ohm/2.5A  [L0603]  47.62,28.57 270 top
LED1  GREEN  [CHIPLED_0603]  26.04,26.04 90 top
LED2  GREEN  [CHIPLED_0603]  26.04,27.94 90 top
LED3  GREEN  [CHIPLED_0603]  72.39,130.81 180 top
LED4  YELLOW  [CHIPLED_0603]  77.47,130.81 180 top
LED5  YELLOW  [CHIPLED_0603]  26.04,61.59 270 top
M1  TCAM-ETH  [TCAM-ETH]  104.78,100.33 0 top
M2  TCAM-ETH  [TCAM-ETH]  141.6,100.33 0 top
M3  TCAM-ETH  [TCAM-ETH]  104.78,57.15 0 top
M4  TCAM-ETH  [TCAM-ETH]  141.6,57.15 0 top
M5  TCAM-ETH  [TCAM-ETH]  104.78,13.97 0 top
M6  TCAM-ETH  [TCAM-ETH]  141.6,13.97 0 top
M7  [FREEWAVE_Z9_PC]  108.91,44.48 90 bottom
PS1  RPX-4.0-CT  [CONV_RPX-4.0-CT]  29.21,21.59 270 top
PS2  RPX-4.0-CT  [CONV_RPX-4.0-CT]  73.66,10.16 180 top
Q1  SI4447ADY-T1-GE3  [SO8]  59.69,7.62 180 top
R1  10 kohm  [R0603]  48.9,8.89 270 top
R2  2.37 kohm  [R0603]  27.94,16.51 180 top
R3  10 kohm  [R0603]  24.77,17.14 90 top
R4  2.2 kohm  [R0603]  22.23,26.04 0 top
R5  4.3 kohm  [R0603]  69.22,10.79 90 top
R6  10 kohm  [R0603]  67.31,12.7 90 top
R7  1 kohm  [R0603]  22.23,27.94 0 top
R8  10 kohm  [R0603]  62.23,22.23 180 top
R9  24.9 kohm  [R0603]  61.59,25.4 90 top
R10  2.2 kohm  [R0603]  55.24,84.45 0 top
R11  2.2 kohm  [R0603]  36.17,80.72 180 bottom
R12  2.2 kohm  [R0603]  36.17,78.16 180 bottom
R13  10 kohm  [R0603]  17.14,113.03 270 top
R14  10 kohm  [R0603]  24.13,76.2 180 top
R15  4.7 kohm  [R0603]  83.19,121.28 270 top
R16  4.7 kohm  [R0603]  85.72,121.28 270 top
R17  10 kohm  [R0603]  19.05,46.35 180 top
R18  1 kohm  [R0603]  74.93,130.81 270 top
R19  1 kohm  [R0603]  80.01,130.81 270 top
R20  3 kohm  [R0603]  59.05,49.53 0 top
R21  10 kohm  [R0603]  33.66,66.67 180 top
R22  499 kohm  [R0603]  39.37,36.2 90 top
R23  3 kohm  [R0603]  33.66,68.58 180 top
R24  3 kohm  [R0603]  33.66,70.48 180 top
R25  10 kohm  [R0603]  27.3,34.29 0 top
R26  10 kohm  [R0603]  42.55,71.12 180 top
R27  1 kohm  [R0603]  26.04,58.42 180 top
R28  1 kohm  [R0603]  26.04,55.88 180 top
R29  1 kohm  [R0603]  26.04,53.34 180 top
R30  1 kohm  [R0603]  26.04,50.8 180 top
R31  1 kohm  [R0603]  26.04,48.26 180 top
R32  1 kohm  [R0603]  26.04,45.72 180 top
R33  1 kohm  [R0603]  26.04,43.18 180 top
R34  1 kohm  [R0603]  26.04,40.64 180 top
R35  1 kohm  [R0603]  29.21,61.59 180 top
R36  33 ohm  [R0603]  73.03,78.74 0 bottom
R37  33 ohm  [R0603]  73.03,80.01 0 bottom
R38  33 ohm  [R0603]  73.03,83.82 0 bottom
R39  33 ohm  [R0603]  73.03,82.55 0 bottom
R40  33 ohm  [R0603]  71.12,69.85 0 bottom
R41  33 ohm  [R0603]  71.12,71.12 0 bottom
R42  33 ohm  [R0603]  71.12,67.31 0 bottom
R43  33 ohm  [R0603]  71.12,66.04 0 bottom
R44  33 ohm  [R0603]  81.28,55.88 0 bottom
R45  33 ohm  [R0603]  81.28,57.15 0 bottom
R46  33 ohm  [R0603]  81.28,53.34 0 bottom
R47  33 ohm  [R0603]  81.28,52.07 0 bottom
R48  33 ohm  [R0603]  81.28,60.33 0 bottom
R49  33 ohm  [R0603]  81.28,61.59 0 bottom
R50  33 ohm  [R0603]  81.28,65.41 0 bottom
R51  33 ohm  [R0603]  81.28,64.14 0 bottom
R52  33 ohm  [R0603]  81.28,22.23 0 bottom
R53  33 ohm  [R0603]  81.28,23.5 0 bottom
R54  33 ohm  [R0603]  81.28,27.3 0 bottom
R55  33 ohm  [R0603]  81.28,26.04 0 bottom
R56  33 ohm  [R0603]  81.28,34.29 0 bottom
R57  33 ohm  [R0603]  81.28,35.56 0 bottom
R58  33 ohm  [R0603]  81.28,31.75 0 bottom
R59  33 ohm  [R0603]  81.28,30.48 0 bottom
R60  49.9 ohm  [R0603]  70.48,48.16 180 bottom
R61  49.9 ohm  [R0603]  70.48,45.72 180 bottom
R62  49.9 ohm  [R0603]  70.48,41.91 180 bottom
R63  49.9 ohm  [R0603]  70.48,39.47 180 bottom
R64  75 ohm  [R0603]  86.36,40.64 0 bottom
R65  75 ohm  [R0603]  86.36,46.99 0 bottom
R66  33 ohm  [R0603]  51.44,68.58 0 bottom
R67  33 ohm  [R0603]  51.44,69.85 0 bottom
R68  33 ohm  [R0603]  51.44,72.39 0 bottom
R69  33 ohm  [R0603]  51.44,73.66 0 bottom
R70  220 ohm  [R0603]  35.56,127.64 180 top
S1  DM3CS-SF  [HRS_DM3CS-SF]  8.26,123.19 270 top
SW1  1101M2S3AQE2  [SIDE_PWR_SPDT]  12.7,15.24 90 top
T1  HX2019FNLT  [XFMR_HX2019FNLT]  78.74,43.81 0 top
TP1  SINGLE_PADSMD_R15  [1_5MM_R_SMD_PAD]  34.92,73.03 0 top
TP2  SINGLE_PADSMD_R15  [1_5MM_R_SMD_PAD]  32.38,73.03 0 top
TP3  SINGLE_PADSMD_R15  [1_5MM_R_SMD_PAD]  37.47,73.03 0 top
TP4  SINGLE_PADSMD_R15  [1_5MM_R_SMD_PAD]  74.3,73.66 0 top
TP5  SINGLE_PADSMD_R15  [1_5MM_R_SMD_PAD]  47.5,71.12 0 top
U1  AP7363-SP  [SO8_PAD]  67.31,21.59 0 top
U2  RT9742GGJ5  [TSOT-23-5]  13.97,113.03 270 top
U3  RT9742GGJ5  [TSOT-23-5]  20.95,74.3 0 top
U4  SP3002-04JTG  [SOT65P220X95-6N]  17.78,59.69 180 top
U5  RT9742SNGV  [SOT23-3]  11.43,93.98 270 top
U6  PCF85063AT/AAZ  [SO8]  17.14,99.69 0 top
U7  EMC2301-1-ACZL-TR  [MSOP8]  19.05,50.16 270 top
U8  KS8997  [PQFP128-PQ]  46.99,49.53 90 top
U9  DNP  [SOT95P270X145-5N]  38.1,67.94 90 top
XTAL1  SC32S-7PF20PPM  [CRYSTAL-3215]  15.88,93.98 180 top
XTAL2  25 MHz  [CRYSTAL-3225]  36.2,35.56 90 top